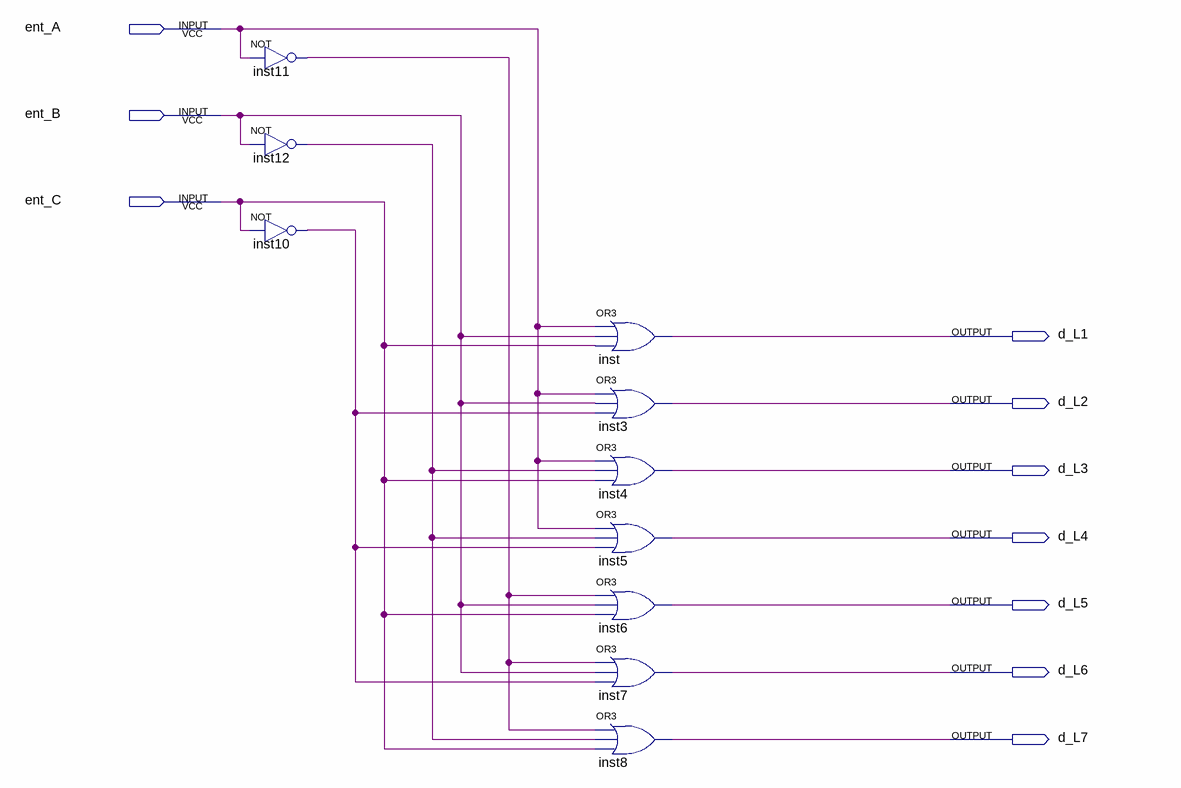
[diagram p0: schematic sheet]
// Quartus schematic Decodificador_Linhas.bdf as structural Verilog: 10 symbols, 10 pins
module Decodificador_Linhas (
  input  ent_A,
  input  ent_B,
  input  ent_C,
  output d_L1,
  output d_L2,
  output d_L3,
  output d_L4,
  output d_L5,
  output d_L6,
  output d_L7
);

  wire inst10_out, inst11_out, inst12_out;

  not inst11 (inst11_out, ent_A);
  not inst12 (inst12_out, ent_B);
  not inst10 (inst10_out, ent_C);
  or inst (d_L1, ent_A, ent_B, ent_C);
  or inst3 (d_L2, ent_A, ent_B, inst10_out);
  or inst4 (d_L3, ent_A, inst12_out, ent_C);
  or inst5 (d_L4, ent_A, inst12_out, inst10_out);
  or inst6 (d_L5, inst11_out, ent_B, ent_C);
  or inst7 (d_L6, inst11_out, ent_B, inst10_out);
  or inst8 (d_L7, inst11_out, inst12_out, ent_C);
endmodule
